# Altium schematic sheet Combo 1.SchDoc
size 297 x 209 mm
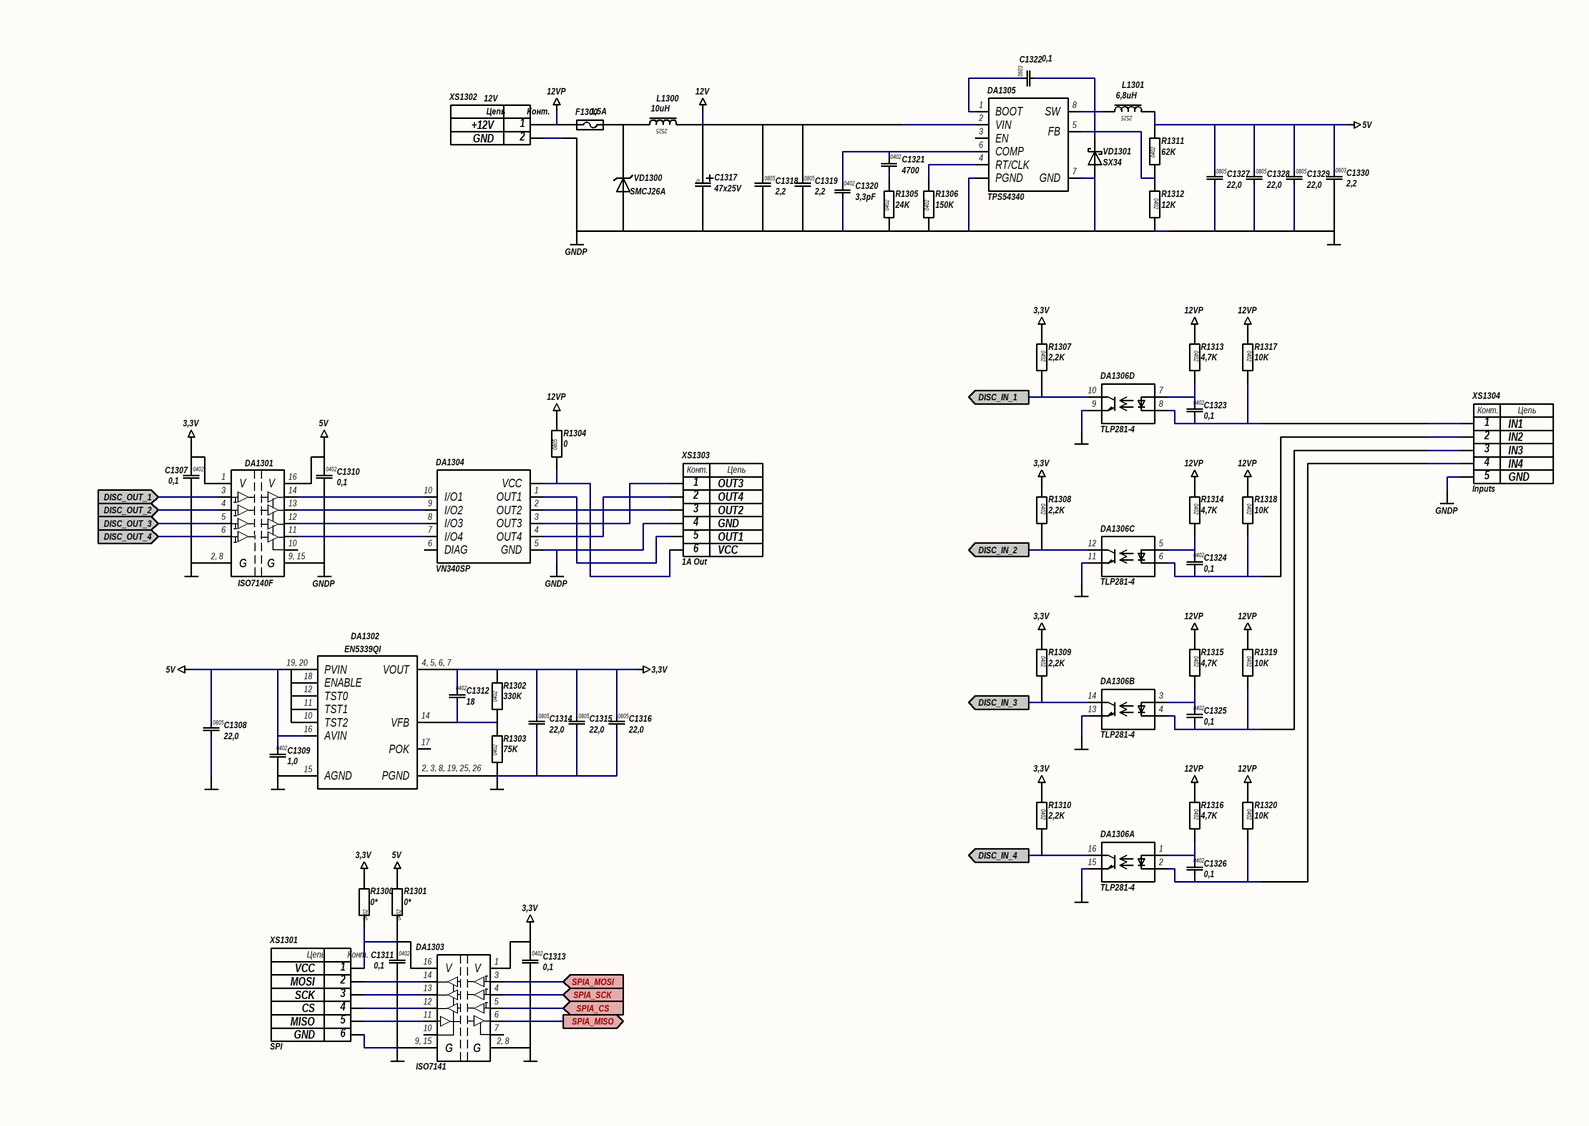
[diagram p0: Combo 1.SchDoc]

## Parts
*1300  Перемычка  [Перемычка]  (value not drawn)
C1307  0,1  [CAP0402]
C1308  22,0  [CAP0805]
C1309  1,0  [CAP0402]
C1310  0,1  [CAP0402]
C1311  0,1  [CAP0402]
C1312  18  [CAP0402]
C1313  0,1  [CAP0402]
C1314  22,0  [CAP0805]
C1315  22,0  [CAP0805]
C1316  22,0  [CAP0805]
C1317  47x25V  [CAP_D]
C1318  2,2  [CAP0805]
C1319  2,2  [CAP0805]
C1320  3,3pF  [CAP0402]
C1321  4700  [CAP0402]
C1322  0,1  [CAP0603]
C1323  0,1  [CAP0402]
C1324  0,1  [CAP0402]
C1325  0,1  [CAP0402]
C1326  0,1  [CAP0402]
C1327  22,0  [CAP0805]
C1328  22,0  [CAP0805]
C1329  22,0  [CAP0805]
C1330  2,2  [CAP0603]
DA1301  ISO7140F  [TSSOP16]
DA1302  EN5339QI  [EN5339QI]
DA1303  ISO7141  [TSSOP16]
DA1304  VN340SP  [PowerSO10]
DA1305  TPS54340  [SO8-3.9_P]
DA1306  TLP281-4  [SOP16]  (parts A,B,C,D of 4)
F1300  1,5A  [MF-MSMF]
L1300  10uH  [IND2525]
L1301  6,8uH  [IND2525]
R1300  0*  [RES0402]
R1301  0*  [RES0402]
R1302  330K  [RES0402]
R1303  75K  [RES0402]
R1304  0  [RES0805]
R1305  24K  [RES0402]
R1306  150K  [RES0402]
R1307  2,2K  [RES0402]
R1308  2,2K  [RES0402]
R1309  2,2K  [RES0402]
R1310  2,2K  [RES0402]
R1311  62K  [RES0402]
R1312  12K  [RES0402]
R1313  4,7K  [RES0402]
R1314  4,7K  [RES0402]
R1315  4,7K  [RES0402]
R1316  4,7K  [RES0402]
R1317  10K  [RES0402]
R1318  10K  [RES0402]
R1319  10K  [RES0402]
R1320  10K  [RES0402]
VD1300  SMCJ26A  [SMC]
VD1301  SX34  [SMA]
XS1301  SPI  [MW-6M]
XS1302  12V  [uF-2X1R]
XS1303  1A Out  [uF-2X3R]
XS1304  Inputs  [MW-5M]

## Ports
DISC_IN_1 (out), DISC_IN_2 (out), DISC_IN_3 (out), DISC_IN_4 (out), DISC_OUT_1 (in), DISC_OUT_2 (in), DISC_OUT_3 (in), DISC_OUT_4 (in), SPIA_CS (in), SPIA_MISO (out), SPIA_MOSI (in), SPIA_SCK (in)

## Nets
3,3V: C1307.1 C1312.1 C1313.1 C1314.1 C1315.1 C1316.1 DA1301.1(V) DA1302.4(VOUT) DA1302.5(VOUT) DA1302.6(VOUT) DA1302.7(VOUT) DA1303.1(V) R1300.2 R1302.2 R1307.1 R1308.1 R1309.1 R1310.1
5V: C1308.1 C1309.1 C1310.1 C1327.1 C1328.1 C1329.1 C1330.1 DA1301.16(V) DA1302.10(TST2) DA1302.11(TST1) DA1302.12(TST0) DA1302.16(AVIN) DA1302.18(ENABLE) DA1302.19(PVIN) DA1302.20(PVIN) L1301.2 R1301.2 R1311.2
12V: C1317.1 C1318.1 C1319.1 DA1305.2(VIN) L1300.2
12VP: F1300.1 R1304.2 R1313.1 R1314.1 R1315.1 R1316.1 R1317.1 R1318.1 R1319.1 R1320.1 XS1302.1(+12V)
GND: *1300.2 C1307.2 C1308.2 C1309.2 C1311.2 C1313.2 C1314.2 C1315.2 C1316.2 C1327.2 C1328.2 C1329.2 C1330.2 DA1301.2(G) DA1301.8(G) DA1302.2(PGND) DA1302.3(PGND) DA1302.8(PGND) DA1302.9(PGND) DA1302.15(AGND) DA1302.25(PGND) DA1302.26(PGND) DA1303.2(G) DA1303.8(G) DA1303.9(G) DA1303.15(G) DA1306.9 DA1306.11 DA1306.13 DA1306.15 R1303.1 XS1301.6(GND)
GNDP: *1300.1 C1310.2 C1317.2 C1318.2 C1319.2 C1320.2 DA1301.9(G) DA1301.15(G) DA1304.5(GND) DA1305.0(PGND) DA1305.7(GND) R1305.1 R1306.1 R1312.2 VD1300.1 VD1301.1 XS1302.2(GND) XS1303.4(GND) XS1304.5(GND)
DISC_IN_1: DA1306.10 R1307.2 ; port DISC_IN_1
DISC_IN_2: DA1306.12 R1308.2 ; port DISC_IN_2
DISC_IN_3: DA1306.14 R1309.2 ; port DISC_IN_3
DISC_IN_4: DA1306.16 R1310.2 ; port DISC_IN_4
DISC_OUT_1: DA1301.3(INA) ; port DISC_OUT_1
DISC_OUT_2: DA1301.4(INB) ; port DISC_OUT_2
DISC_OUT_3: DA1301.5(INC) ; port DISC_OUT_3
DISC_OUT_4: DA1301.6(IND) ; port DISC_OUT_4
SPIA_CS: DA1303.5(INC) ; port SPIA_CS
SPIA_MISO: DA1303.6(OUTD) ; port SPIA_MISO
SPIA_MOSI: DA1303.3(INA) ; port SPIA_MOSI
SPIA_SCK: DA1303.4(INB) ; port SPIA_SCK
NetC1311_1: C1311.1 DA1303.16(V) R1300.1 R1301.1 XS1301.1(VCC)
NetC1312_2: C1312.2 DA1302.14(VFB) R1302.1 R1303.2
NetC1320_1: C1320.1 C1321.1 DA1305.6(COMP)
NetC1321_2: C1321.2 R1305.2
NetC1322_1: C1322.1 DA1305.1(BOOT)
NetC1322_2: C1322.2 DA1305.8(SW) L1301.1 VD1301.2
NetC1323_1: C1323.1 DA1306.7 R1313.2
NetC1323_2: C1323.2 DA1306.8 R1317.2 XS1304.1(IN1)
NetC1324_1: C1324.1 DA1306.5 R1314.2
NetC1324_2: C1324.2 DA1306.6 R1318.2 XS1304.2(IN2)
NetC1325_1: C1325.1 DA1306.3 R1315.2
NetC1325_2: C1325.2 DA1306.4 R1319.2 XS1304.3(IN3)
NetC1326_1: C1326.1 DA1306.1 R1316.2
NetC1326_2: C1326.2 DA1306.2 R1320.2 XS1304.4(IN4)
NetDA1301_11: DA1301.11(OUTD) DA1304.7(I/O4)
NetDA1301_12: DA1301.12(OUTC) DA1304.8(I/O3)
NetDA1301_13: DA1301.13(OUTB) DA1304.9(I/O2)
NetDA1301_14: DA1301.14(OUTA) DA1304.10(I/O1)
NetDA1303_11: DA1303.11(IND) XS1301.5(MISO)
NetDA1303_12: DA1303.12(OUTC) XS1301.4(CS)
NetDA1303_13: DA1303.13(OUTB) XS1301.3(SCK)
NetDA1303_14: DA1303.14(OUTA) XS1301.2(MOSI)
NetDA1304_0: DA1304.0(VCC) R1304.1 XS1303.6(VCC)
NetDA1304_1: DA1304.1(OUT1) XS1303.5(OUT1)
NetDA1304_2: DA1304.2(OUT2) XS1303.3(OUT2)
NetDA1304_3: DA1304.3(OUT3) XS1303.1(OUT3)
NetDA1304_4: DA1304.4(OUT4) XS1303.2(OUT4)
NetDA1305_4: DA1305.4(RT/CLK) R1306.2
NetDA1305_5: DA1305.5(FB) R1311.1 R1312.1
NetF1300_2: F1300.2 L1300.1 VD1300.2

Not connected (* = marked no-connect by the designer): DA1301 10(EN); DA1302 17(POK); DA1303 7(EN1) 10(EN2); DA1304 6(DIAG); DA1305 3(EN)

## Notes on the sheet
- (in symbol EN5339QI) 19, 20; 4, 5, 6, 7; 2, 3, 8, 19, 25, 26
- (in symbol ISO7140F) 2, 8; 9, 15
- (in symbol ISO7141) 9, 15; 2, 8
- (in symbol Разъем2_1) Цепь; Конт.
- (in symbol Разъем5) Конт.; Цепь
- (in symbol Разъем6) Конт.; Цепь

## Library data of the parts
C1307 C1309 C1311 C1312 C1320 C1321 = CAP_0402: Конденсатор чип; Тип корпуса: 0402; Тип монтажа: Поверхностный; Тип компонента: Конденсатор чип
  C1307 C1311: Value: 0,1; Номинал: 0,1
  C1309: Номинал: 1,0
  C1312: Номинал: 18
  C1320: Value: 3,3pF; Номинал: 3,3pF
  C1321: Value: 4700; Номинал: 4700
C1308 C1314-C1316 C1318 C1319 C1327-C1329 = CAP_0805: Конденсатор чип; Тип корпуса: 0805; Тип монтажа: Поверхностный; Тип компонента: Конденсатор чип
  C1308 C1314-C1316 C1327-C1329: Номинал: 22,0; Value: 22,0
  C1318 C1319: Value: 2,2; Номинал: 2,2
C1310 C1313 C1323-C1326 = CAP_0402: Конденсатор чип; Напряжение: 16V; Тип корпуса: 0402; Тип монтажа: Поверхностный; Номинал: 0,1; Тип компонента: Конденсатор чип; Value: 0,1
C1317 = CAP_D: Конденсатор танталовый; Тип корпуса: Тип D; Тип монтажа: Поверхностный; Тип: D; Номинал: 47x25V; Тип компонента: Конденсатор танталовый; Value: 47x25V
C1322 C1330 = CAP_0603: Конденсатор чип; Напряжение: 50V; Тип корпуса: 0603; Тип монтажа: Поверхностный; Тип компонента: Конденсатор чип
  C1322: Value: 0,1; Номинал: 0,1
  C1330: Value: 2,2; Номинал: 2,2
DA1301 = ISO7140F: Цифровой изолятор 4 вых; Производитель: Texas Instruments; Тип корпуса: SSOP16; Тип монтажа: Поверхностный; Наименование: ISO7140F; Тип компонента: Цифровой изолятор 4 вых
DA1302 = EN5339QI: DC преобразователь понижающий; Производитель: Altera; Тип монтажа: Поверхностный; Характеристики: 2.4-5.5Ввх 0.6-5.0Ввых 3А; Наименование: EN5339QI; Тип компонента: DC преобразователь понижающий
DA1303 = ISO7141: Цифровой изолятор 3 вх 1 вых; Производитель: Texas Instruments; Тип корпуса: SSOP16; Тип монтажа: Поверхностный; Наименование: ISO7141; Тип компонента: Цифровой изолятор 3 вх 1 вых
DA1304 = VN340SP: Драйвер MOSFET верхнего плеча 4 шт.; Производитель: STmicroelectronics; Тип корпуса: PowerSO-10; Тип монтажа: Поверхностный; Характеристики: 36В, 1А, 0.2Ом; Наименование: VN340SP; Тип компонента: Драйвер MOSFET верхнего плеча 4 шт.
DA1305 = TPS54340: DC преобразователь понижающий; Производитель: Texas Instruments; Тип компонента: Регулятор; Тип корпуса: HSOP; Тип монтажа: Поверхностный; Характеристики: 4.5...42В вх, 0.8...41В вых, 3.5А; Наименование: TPS54340
DA1306 = TLP281-4_1: Оптопара 4 канала; Производитель: Toshiba; Тип корпуса: SO16; Тип монтажа: Поверхностный; Характеристики: 80В 50мА; Наименование: TLP281-4; Тип компонента: Оптопара 4 канала
F1300 = MF-MSMF: Предохранитель самовосстанавливающийся; Тип монтажа: Поверхностный; Производитель: Bourns; Наименование: MF-MSMF; Номинал: 1,5A; Тип компонента: Предохранитель самовосстанавливающийся; Тип корпуса: MF-MSMF; Value: 1,5A
L1300 L1301 = IND_2525: Индуктивность чип; Тип корпуса: 2525; Тип монтажа: Поверхностный; Тип компонента: Индуктивность чип
  L1300: Номинал: 10uH; Value: 10uH
  L1301: Номинал: 6,8uH; Value: 6,8uH
R1300-R1303 R1305-R1320 = RES_0402: Резистор чип; Тип корпуса: 0402; Тип монтажа: Поверхностный; Характеристики: 0.062Вт 50В; Тип компонента: Резистор чип
  R1300 R1301: Номинал: 0*; Value: 0*
  R1302: Номинал: 330K; Value: 330K
  R1303: Номинал: 75K; Value: 75K
  R1305: Номинал: 24K; Value: 24K
  R1306: Номинал: 150K; Value: 150K
  R1307-R1310: Номинал: 2,2K; Value: 2,2K
  R1311: Номинал: 62K; Value: 62K
  R1312: Номинал: 12K; Value: 12K
  R1313-R1316: Номинал: 4,7K; Value: 4,7K
  R1317-R1320: Номинал: 10K; Value: 10K
R1304 = RES_0805: Резистор чип; Тип корпуса: 0805; Тип монтажа: Поверхностный; Характеристики: 0.125Вт 150В; Номинал: 0; Тип компонента: Резистор чип; Value: 0
VD1300 = SMCJxx: Диод TVS; Тип монтажа: Поверхностный; Характеристики: 1500 Вт; Тип компонента: Диод TVS; Тип корпуса: SMC; Наименование: SMCJ26A
VD1301 = SX34: Диод Шоттки; Тип монтажа: Поверхностный; Характеристики: 28В 3А; Производитель: WTE; Тип корпуса: SMA; Наименование: SX34; Тип компонента: Диод Шоттки
XS1301 XS1303 = Разъем6: Разъем
XS1302 = Разъем2_1: Разъем
XS1304 = Разъем5: Разъем